# Altium schematic sheet cc2530.SchDoc
size A2
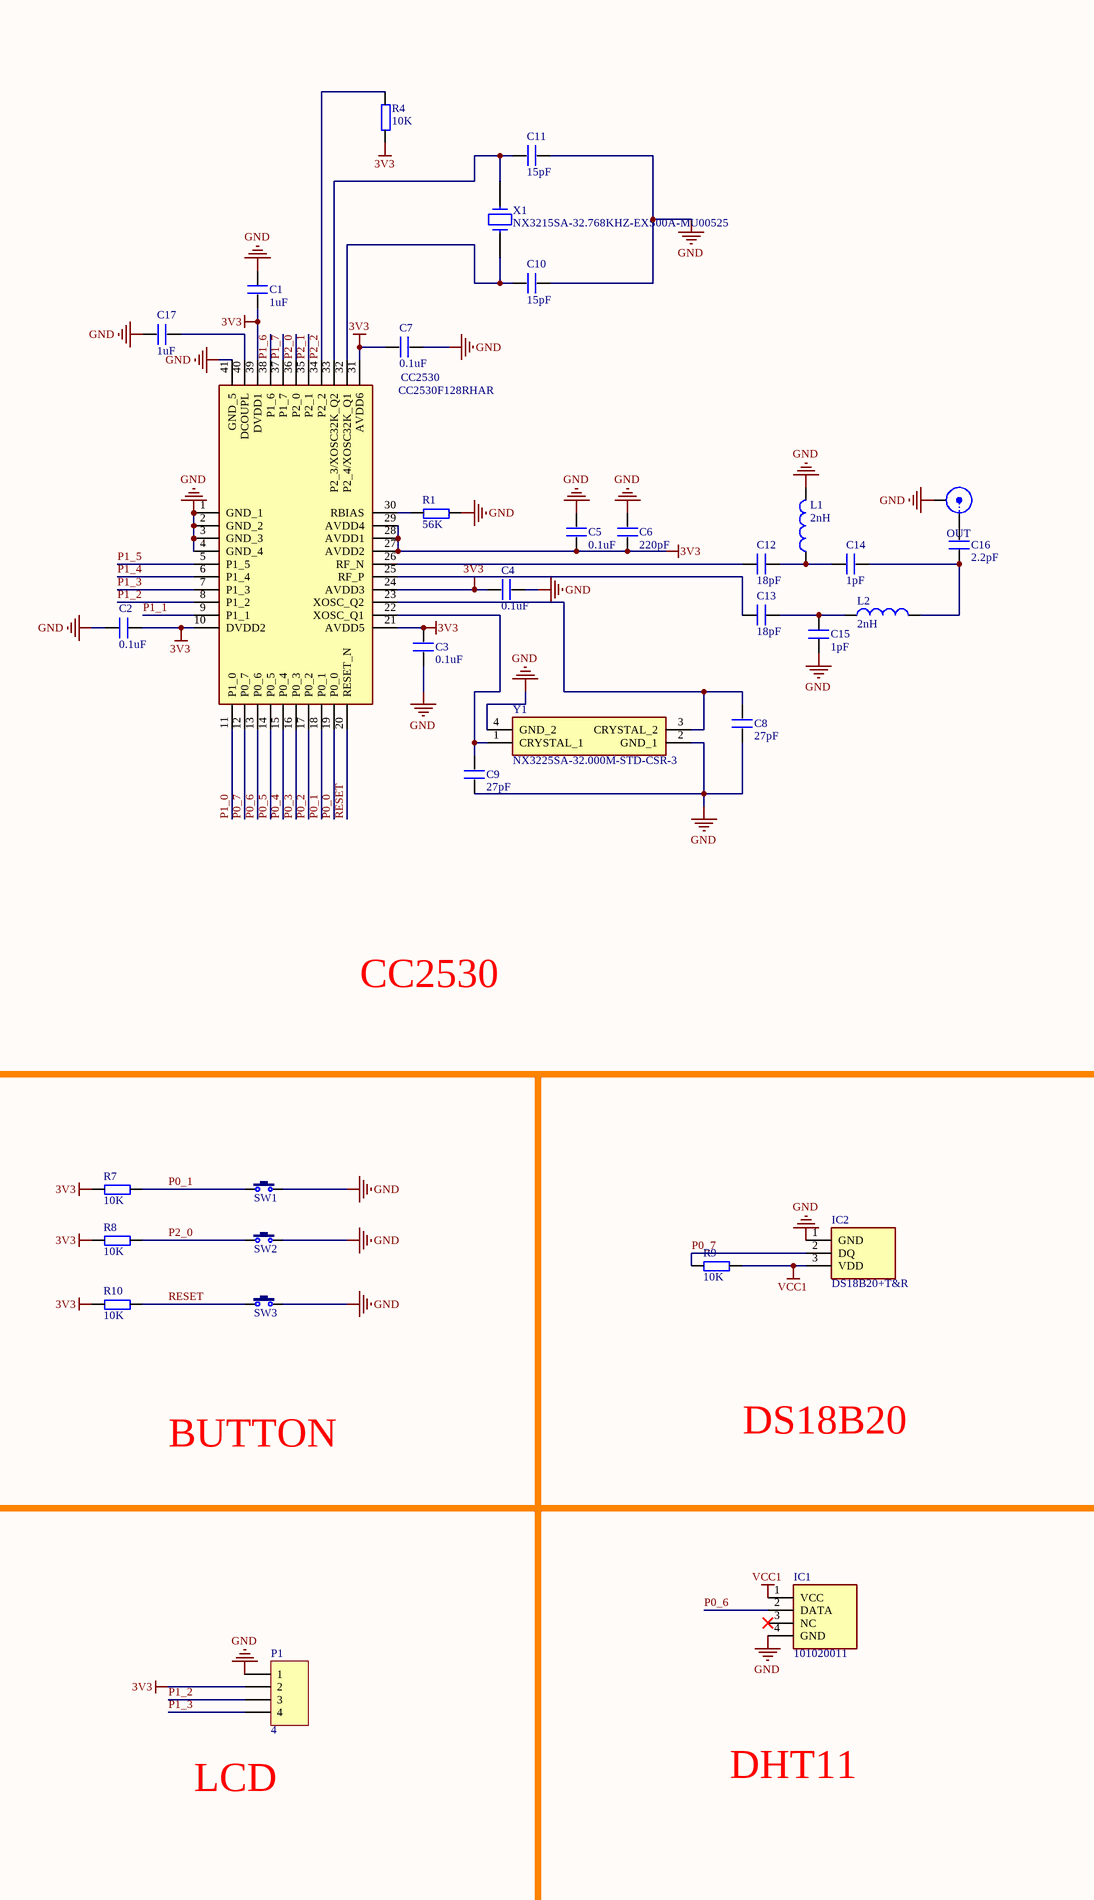
[diagram p0: cc2530.SchDoc, left]
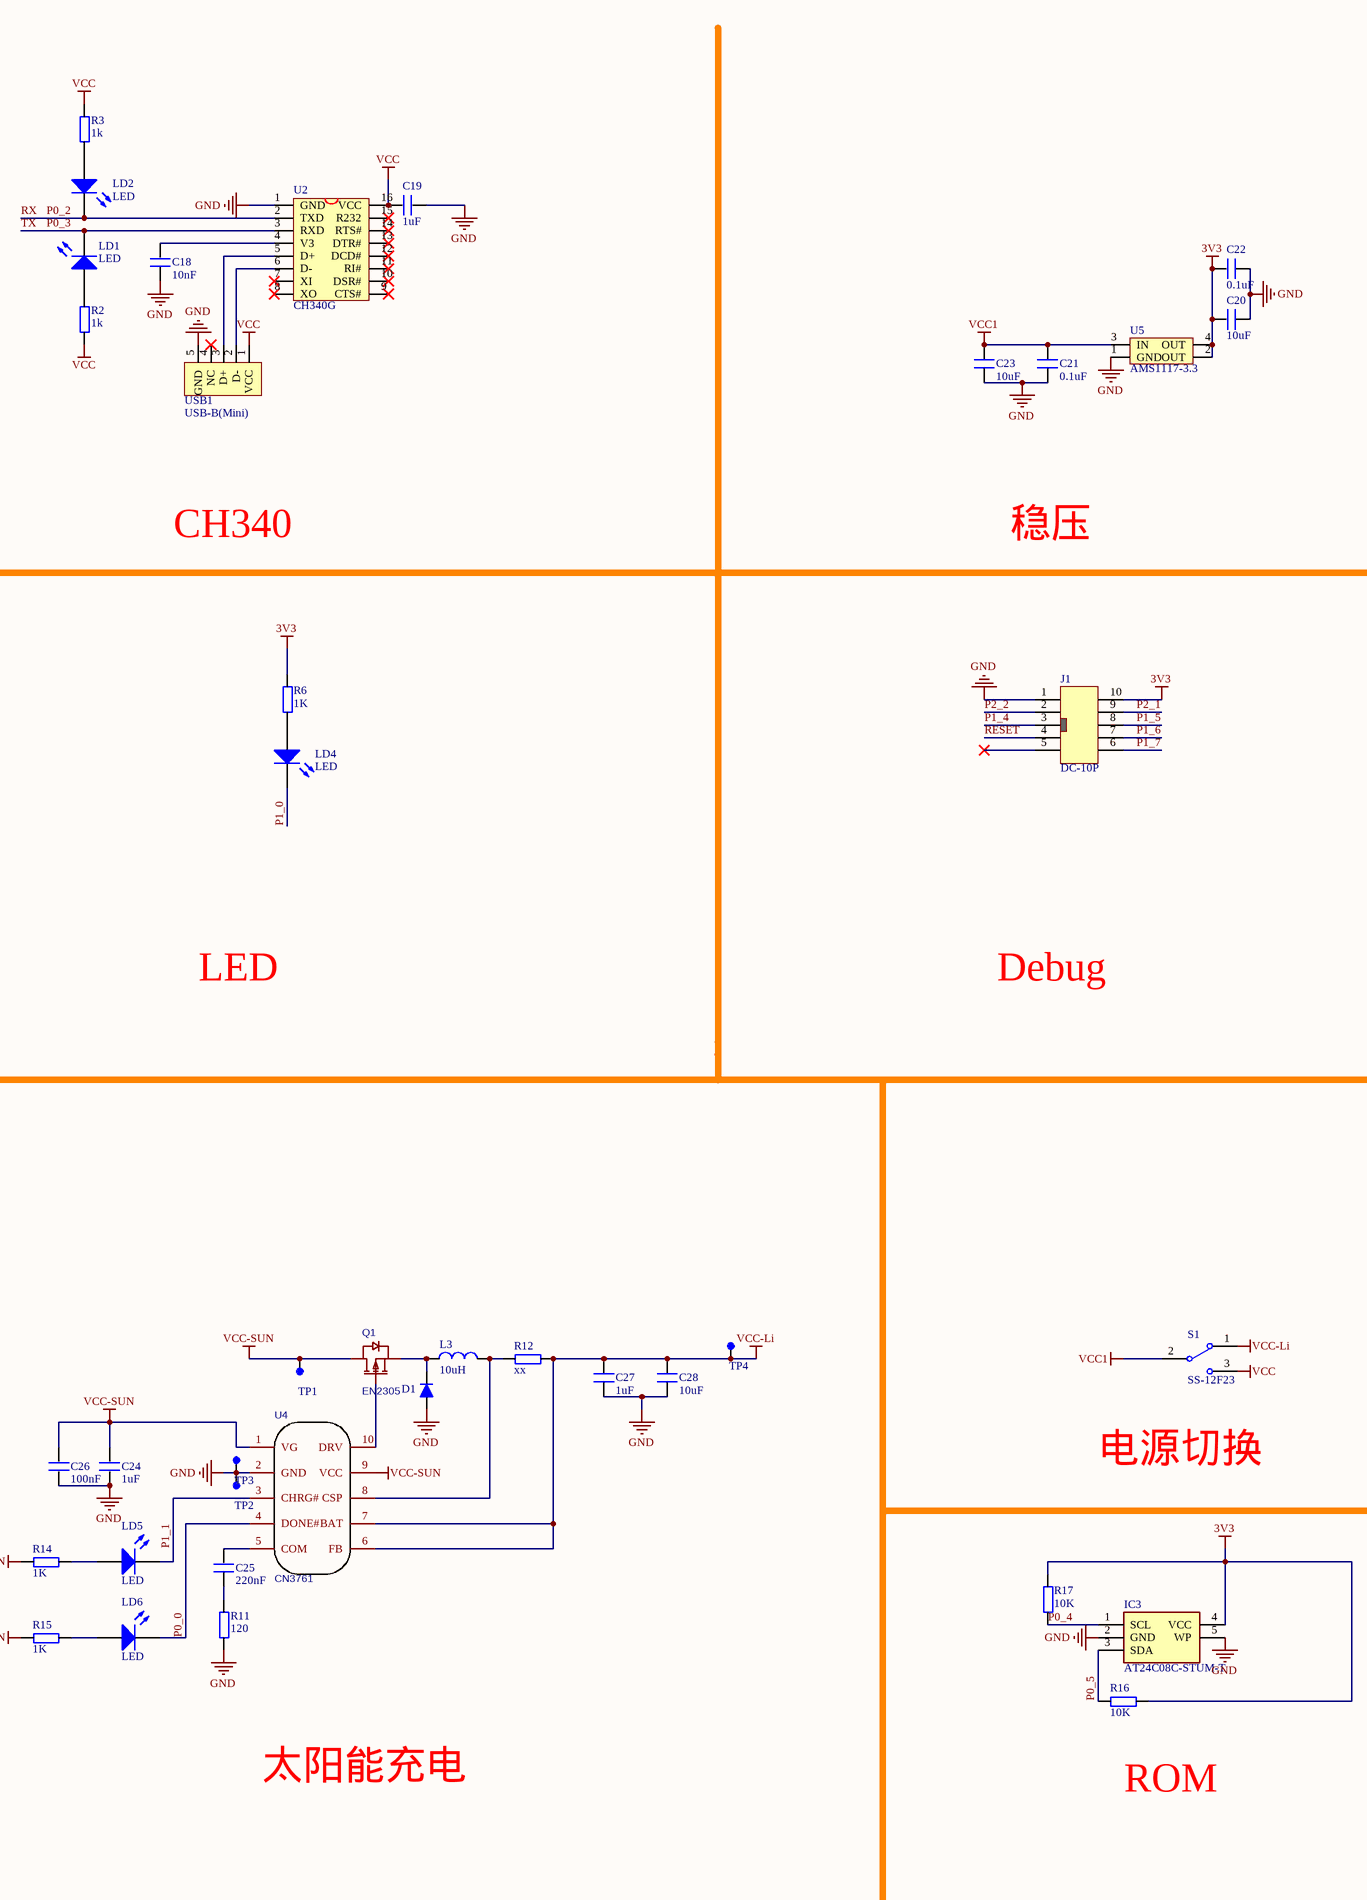
[diagram p1: cc2530.SchDoc, right]

## Parts
C1  1uF  [0402]
C2  0.1uF  [0402]
C3  0.1uF  [0402]
C4  0.1uF  [0402]
C5  0.1uF  [0402]
C6  220pF  [0402]
C7  0.1uF  [0402]
C8  27pF  [0603C]
C9  27pF  [0603C]
C10  15pF  [0603C]
C11  15pF  [0603C]
C12  18pF  [0402]
C13  18pF  [0402]
C14  1pF  [0402]
C15  1pF  [0402]
C16  2.2pF  [0402]
C17  1uF  [0402]
C18  10nF  [0603C]
C19  1uF  [0603C]
C20  10uF  [0603C]
C21  0.1uF  [0603C]
C22  0.1uF  [0603C]
C23  10uF  [0603C]
C24  1uF  [0603C]
C25  220nF  [0603C]
C26  100nF  [0603C]
C27  1uF  [0603C]
C28  10uF  [0603C]
CC2530  CC2530F128RHAR  [QFN50P600X600X100-41N-D]
D1  D  [D-SMA]  (value not drawn)
IC1  101020011  [HDRV4W80P0X254_1X4_1200X500X1550P]
IC2  DS18B20+T&R  [DS18B20TR]
IC3  AT24C08C-STUM-T  [SOT95P280X100-5N]
J1  DC-10P  [DC-10P]
L1  2nH  [0402]
L2  2nH  [0402]
L3  10uH  [L-6.5mm]
LD1  LED  [SMDLED]
LD2  LED  [SMDLED]
LD4  LED  [SMDLED]
LD5  LED  [SMDLED]
LD6  LED  [SMDLED]
OUT  SMA  [SMA]  (value not drawn)
P1  4  [HDR1X4]
Q1  EN2305  [CN2305]
R1  56K  [0402]
R2  1k  [0603R]
R3  1k  [0603R]
R4  10K  [0603R]
R6  1K  [0603R]
R7  10K  [0603R]
R8  10K  [0603R]
R9  10K  [0603R]
R10  10K  [0603R]
R11  120  [0603R]
R12  xx  [0603R]
R14  1K  [0402]
R15  1K  [0402]
R16  10K  [0603R]
R17  10K  [0603R]
S1  SS-12F23  [MSK-12C01-07]
SW1  3x6x5  [TSW SMD-3*6*2.5]  (value not drawn)
SW2  3x6x5  [TSW SMD-3*6*2.5]  (value not drawn)
SW3  3x6x5  [TSW SMD-3*6*2.5]  (value not drawn)
TP1  test point  [TP]  (value not drawn)
TP2  test point  [TP]  (value not drawn)
TP3  test point  [TP]  (value not drawn)
TP4  test point  [TP]  (value not drawn)
U2  CH340G  [SOP16M]
U4  CN3761  [CN3761]
U5  AMS1117-3.3  [AMS1117]
USB1  USB-B(Mini)  [USB/SM0.8-6H5]
X1  NX3215SA-32.768KHZ-EXS00A-MU00525  [XTAL_2SM_3R2X1R5]
Y1  NX3225SA-32.000M-STD-CSR-3  [NX3225SA12000MSTDCSR3]

## Nets
3V3: C1.1 C2.2 C3.1 C4.1 C5.1 C6.1 C7.1 C20.2 C22.2 CC2530.10(DVDD2) CC2530.21(AVDD5) CC2530.24(AVDD3) CC2530.27(AVDD2) CC2530.28(AVDD1) CC2530.29(AVDD4) CC2530.31(AVDD6) CC2530.39(DVDD1) IC3.4(VCC) J1.10 P1.2 R4.1 R6.2 R7.1 R8.1 R10.1 R16.2 R17.2 U5.2(OUT) U5.4(OUT)
GND: C1.2 C2.1 C3.2 C4.2 C5.2 C6.2 C7.2 C8.1 C9.1 C10.2 C11.2 C15.1 C17.1 C18.1 C19.2 C20.1 C21.1 C22.1 C23.2 C24.1 C26.1 C27.1 C28.1 CC2530.1(GND_1) CC2530.2(GND_2) CC2530.3(GND_3) CC2530.4(GND_4) CC2530.41(GND_5) D1.1 IC1.4(GND) IC2.1(GND) IC3.2(GND) IC3.5(WP) J1.1 L1.2 OUT.2(Y) P1.1 R1.2 R11.1 SW1.2 SW2.2 SW3.2 TP2.1 TP3.1 U2.1(GND) U4.2(GND) U5.1(GND) USB1.5(GND) Y1.2(GND_1) Y1.4(GND_2)
VCC: C19.1 R2.1 R3.2 S1.3 U2.16(VCC) USB1.1(VCC)
VCC1: C21.2 C23.1 IC1.1(VCC) IC2.3(VDD) R9.2 S1.2 U5.3(IN)
VCC-Li: C27.2 C28.2 R12.2 S1.1 TP4.1 U4.6(FB) U4.7(BAT)
VCC-SUN: C24.2 C26.2 Q1.3(D) R14.1 R15.1 TP1.1 U4.1(VG) U4.9(VCC)
P0_0: CC2530.19(P0_0) LD6.2(K) U4.4(DONE#)
P0_1: CC2530.18(P0_1) R7.2 SW1.1
P0_2: CC2530.17(P0_2) LD2.2(K) U2.2(TXD)  [also labelled RX]
P0_3: CC2530.16(P0_3) LD1.2(K) U2.3(RXD)  [also labelled TX]
P0_4: CC2530.15(P0_4) IC3.1(SCL) R17.1
P0_5: CC2530.14(P0_5) IC3.3(SDA) R16.1
P0_6: CC2530.13(P0_6) IC1.2(DATA)
P0_7: CC2530.12(P0_7) IC2.2(DQ) R9.1
P1_0: CC2530.11(P1_0) LD4.2(K)
P1_1: CC2530.9(P1_1) LD5.2(K) U4.3(CHRG#)
P1_2: CC2530.8(P1_2) P1.3
P1_3: CC2530.7(P1_3) P1.4
P1_4: CC2530.6(P1_4) J1.3
P1_5: CC2530.5(P1_5) J1.8
P1_6: CC2530.38(P1_6) J1.7
P1_7: CC2530.37(P1_7) J1.6
P2_0: CC2530.36(P2_0) R8.2 SW2.1
P2_1: CC2530.35(P2_1) J1.9
P2_2: CC2530.34(P2_2) J1.2 R4.2
RESET: CC2530.20(RESET_N) J1.4 R10.2 SW3.1
NetC8_2: C8.2 CC2530.23(XOSC_Q2) Y1.3(CRYSTAL_2)
NetC9_2: C9.2 CC2530.22(XOSC_Q1) Y1.1(CRYSTAL_1)
NetC10_1: C10.1 CC2530.32(P2_4/XOSC32K_Q1) X1.2
NetC11_1: C11.1 CC2530.33(P2_3/XOSC32K_Q2) X1.1
NetC12_1: C12.1 CC2530.26(RF_N)
NetC12_2: C12.2 C14.1 L1.1
NetC13_1: C13.1 CC2530.25(RF_P)
NetC13_2: C13.2 C15.2 L2.1
NetC14_2: C14.2 C16.1 L2.2
NetC16_2: C16.2 OUT.1(X)
NetC17_2: C17.2 CC2530.40(DCOUPL)
NetC18_2: C18.2 U2.4(V3)
NetC25_1: C25.1 R11.2
NetC25_2: C25.2 U4.5(COM)
NetCC2530_30: CC2530.30(RBIAS) R1.1
NetD1_2: D1.2 L3.1 Q1.2(S)
NetL3_2: L3.2 R12.1 U4.8(CSP)
NetLD1_1: LD1.1(A) R2.2
NetLD2_1: LD2.1(A) R3.1
NetLD4_1: LD4.1(A) R6.1
NetLD5_1: LD5.1(A) R14.2
NetLD6_1: LD6.1(A) R15.2
NetQ1_1: Q1.1(G) U4.10(DRV)
NetU2_5: U2.5(D+) USB1.3(D+)
NetU2_6: U2.6(D-) USB1.2(D-)

Not connected (* = marked no-connect by the designer): IC1 3(NC)*; J1 5*; U2 7(XI)* 8(XO)* 9(CTS#)* 10(DSR#)* 11(RI#)* 12(DCD#)* 13(DTR#)* 14(RTS#)* 15(R232)*; USB1 4(NC)*

## Notes on the sheet
- CH340
- 稳压
- LED
- Debug
- CC2530
- BUTTON
- DS18B20
- 电源切换
- (near P1) LCD
- DHT11
- 太阳能充电
- ROM

## Library data of the parts
C1-C28 = C: Capacitor
CC2530 = CC2530F128RHAR: Integrated Circuit; Manufacturer_Name: Texas Instruments; Datasheet Link: http://www.ti.com/lit/gpn/CC2530-RF4CE; Height: 1mm; Manufacturer_Part_Number: CC2530F128RHAR; Mouser Part Number: 595-CC2530F128RHAR; Mouser Price/Stock: https://www.mouser.co.uk/ProductDetail/Texas-Instruments/CC2530F128RHAR?qs=X4N6sOTYzkgp9HkVp9sZXw%3D%3D; Arrow Part Number: CC2530F128RHAR; Arrow Price/Stock: https://www.arrow.com/en/products/cc2530f128rhar/texas-instruments
D1 = Diode: 二极管
IC1 = 101020011: Integrated Circuit; Manufacturer_Name: Seeed Studio; Datasheet Link: https://componentsearchengine.com/Datasheets/1/101020011.pdf; Height: 15.5mm; Manufacturer_Part_Number: 101020011; Mouser Part Number: 713-101020011; Mouser Price/Stock: https://www.mouser.co.uk/ProductDetail/Seeed-Studio/101020011?qs=1%252B9yuXKSi8Dq%252B99bte6U5Q%3D%3D; Arrow Part Number: 101020011; Arrow Price/Stock: https://www.arrow.com/en/products/101020011/seeed-technology-limited
IC2 = DS18B20+T&R: Integrated Circuit; Manufacturer_Name: Maxim Integrated; Datasheet Link: https://componentsearchengine.com/Datasheets/1/DS18B20+T&R.pdf; Height: 10.41mm; Manufacturer_Part_Number: DS18B20+T&R; Mouser Part Number: 700-DS18B20T&R; Mouser Price/Stock: https://www.mouser.co.uk/ProductDetail/Maxim-Integrated/DS18B20%2bTR?qs=7H2Jq%252ByxpJKpIDCbiq4lfg%3D%3D
IC3 = AT24C08C-STUM-T: Integrated Circuit; Manufacturer_Name: Microchip; Datasheet Link: https://www.mouser.com/datasheet/2/268/Atmel-8787-SEEPROM-AT24C04C-08C-Datasheet-1398080.pdf; Height: 1mm; Manufacturer_Part_Number: AT24C08C-STUM-T; Mouser Part Number: 556-AT24C08C-STUM-T; Mouser Price/Stock: https://www.mouser.co.uk/ProductDetail/Microchip-Technology-Atmel/AT24C08C-STUM-T/?qs=TI%2F9gtmDCEHb3Qhj7sWiHQ%3D%3D; Arrow Part Number: AT24C08C-STUM-T; Arrow Price/Stock: https://www.arrow.com/en/products/at24c08c-stum-t/microchip-technology
L1 L2 = Inductor: Value: 100uH; Published: 8-Jun-2000; Revision: July-2002: Re-released for DXP Platform.; Publisher: Altium Limited
L3 = Inductor
LD1 LD2 LD4-LD6 = LED: Typical RED, GREEN, YELLOW, AMBER GaAs LED; Published: 8-Jun-2000; LatestRevisionDate: 17-Jul-2002; LatestRevisionNote: Re-released for DXP Platform.; PackageDocument: Feb-2002; PackageReference: 3.2X1.6X1.1; Publisher: Altium Limited
OUT = SMA: SMA Connector
P1 = Header 4: Header, 4-Pin; LatestRevisionDate: 17-Jul-2002; LatestRevisionNote: Re-released for DXP Platform.; Publisher: Altium Limited
Q1 = EN2305: BOM_Manufacturer: ETERNAL; Contributor: LCSC; BOM_Supplier: LCSC; BOM_Supplier Part: C967035; BOM_Manufacturer Part: EN2305; BOM_JLCPCB Part Class: Extended Part; spicePre: Q; spiceSymbolName: EN2305
R1-R4 R6-R12 R14-R17 = Resistor
S1 = SSW-1P: 1路波动开关; BOM名称: 波动开关; 版权归属: 源创客; 学习资源: www.ooocke.com
SW1-SW3 = TSW 3x6: 3x6轻触开关; 版权归属: 源创客; BOM名称: 3x6轻触开关; 学习资源: www.ooocke.com
TP1-TP4 = TP
U2 = CH340G: USB2UART
U4 = CN3761_1: BOM_Manufacturer: CONSONANCE; BOM_Supplier: LCSC; BOM_Manufacturer Part: CN3761; BOM_Supplier Part: C41308; BOM_JLCPCB Part Class: Extended Part; spicePre: U; spiceSymbolName: CN3761
U5 = AMS1117
USB1 = USB5_1
X1 = XTAL: Crystal
Y1 = NX3225SA-12.000M-STD-CSR-3: Crystal or Oscillator; Manufacturer_Name: Nihon Dempa Kogyo Co.; Datasheet Link: https://www.arrow.com/en/products/nx3225sa12.000mstdcsr3/ndk; Height: 0.6mm; Manufacturer_Part_Number: NX3225SA-12.000M-STD-CSR-3; Arrow Part Number: NX3225SA-12.000M-STD-CSR-3; Arrow Price/Stock: https://www.arrow.com/en/products/nx3225sa12.000mstdcsr3/ndk